# EAGLE design NQSMHS-V2.5b (EAGLE 5.11)

## Sheet 1 of 4
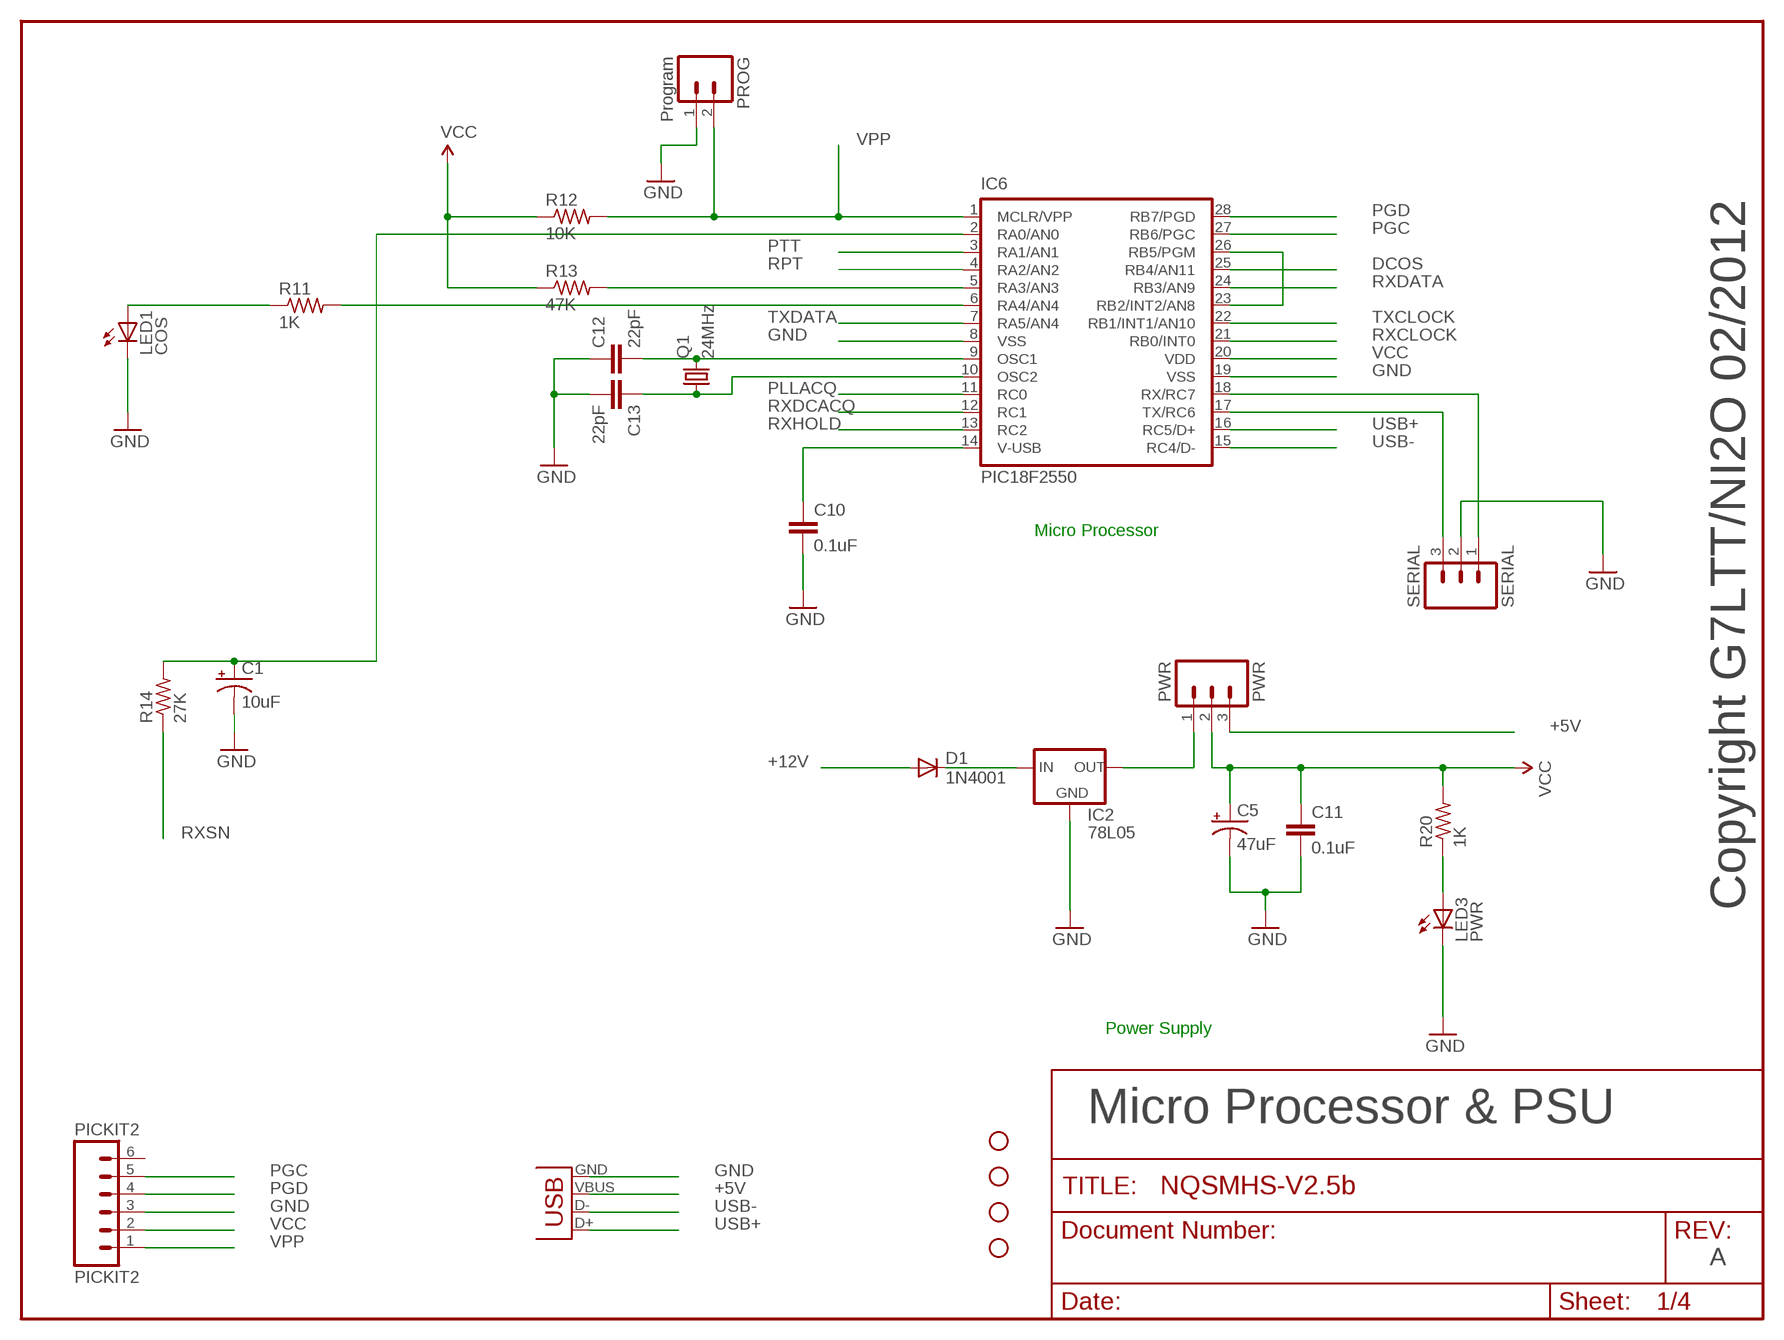
[diagram p0: schematic, sheet 1]

### Parts
C1  10uF  CAP_POLPTH2  [CPOL-RADIAL-10UF-25V]
C5  47uF  CAP_POLPTH2  [CPOL-RADIAL-10UF-25V]
C10  0.1uF  C2.5/2  [C2.5-2]
C11  0.1uF  C2.5/2  [C2.5-2]
C12  22pF  C2.5/2  [C2.5-2]
C13  22pF  C2.5/2  [C2.5-2]
D1  1N4001  DIODEPTH  [DIODE-1N4001]
IC2  78L05  78LXX  [78LXX]
IC6  PIC18F2550  [DIL28-3]
J1  USBPTH  [USB-B-PTH]
JP7  STAND-OFF  [STAND-OFF]
JP8  STAND-OFF  [STAND-OFF]
JP9  STAND-OFF  [STAND-OFF]
JP10  STAND-OFF  [STAND-OFF]
LED1  COS  LED3MM  [LED3MM]
LED3  PWR  LED3MM  [LED3MM]
PICKIT2  PICKIT2  M06SIP  [1X06]
PROG  Program  M02PTH  [1X02]
PWR  PWR  M03PTH  [1X03]
Q1  24MHz  CRYSTALHC49US  [HC49US]
R11  1K  R-US_0207/2V  [0207/2V]
R12  10K  R-US_0207/2V  [0207/2V]
R13  47K  R-US_0207/2V  [0207/2V]
R14  27K  R-US_0207/2V  [0207/2V]
R20  1K  R-US_0207/2V  [0207/2V]
SERIAL  SERIAL  M03PTH  [1X03]

### Nets
+5V: J1.VBUS PWR.3
+12V: D1.A ; also sheet 2
DCOS: IC6.25(RB4/AN11) ; also sheet 3
GND: C1.2(-) C5.2(-) C10.2 C11.2 C12.1 C13.2 IC2.GND IC6.8(VSS) IC6.19(VSS) J1.GND LED1.K(C) LED3.K(C) PICKIT2.3 PROG.1 SERIAL.2 ; also sheet 2,3,4
N$2: D1.C IC2.IN
N$3: IC6.23(RB2/INT2/AN8) IC6.26(RB5/PGM)
N$4: IC6.5(RA3/AN3) R13.2
N$5: IC6.6(RA4/AN4) R11.2
N$6: LED1.A R11.1
N$9: C12.2 IC6.9(OSC1) Q1.2
N$10: C13.1 IC6.10(OSC2) Q1.1
N$11: C10.1 IC6.14(V-USB)
N$12: IC2.OUT PWR.1
N$13: LED3.A R20.1
PGC: IC6.27(RB6/PGC) PICKIT2.5
PGD: IC6.28(RB7/PGD) PICKIT2.4
PLLACQ: IC6.11(RC0) ; also sheet 4
PTT: IC6.3(RA1/AN1) ; also sheet 2
RPT: IC6.4(RA2/AN2)
RX-232: IC6.18(RX/RC7) SERIAL.1
RXCLOCK: IC6.21(RB0/INT0) ; also sheet 4
RXDATA: IC6.24(RB3/AN9) ; also sheet 4
RXDCACQ: IC6.12(RC1) ; also sheet 4
RXHOLD: IC6.13(RC2) ; also sheet 4
RXSN: R14.1 ; also sheet 3,4
TX-232: IC6.17(TX/RC6) SERIAL.3
TX/SN: C1.1(+) IC6.2(RA0/AN0) R14.2
TXCLOCK: IC6.22(RB1/INT1/AN10) ; also sheet 4
TXDATA: IC6.7(RA5/AN4) ; also sheet 4
USB+: IC6.16(RC5/D+) J1.D+
USB-: IC6.15(RC4/D-) J1.D-
VCC: C5.1(+) C11.1 IC6.20(VDD) PICKIT2.2 PWR.2 R12.1 R13.1 R20.2 ; also sheet 2,3,4
VPP: IC6.1(MCLR/VPP) PICKIT2.1 PROG.2 R12.2
Unconnected: PICKIT2.6

### Notes on the sheet
- Micro Processor
- Copyright G7LTT/NI2O 02/2012
- Power Supply
- Micro Processor & PSU
- A

## Sheet 2 of 4
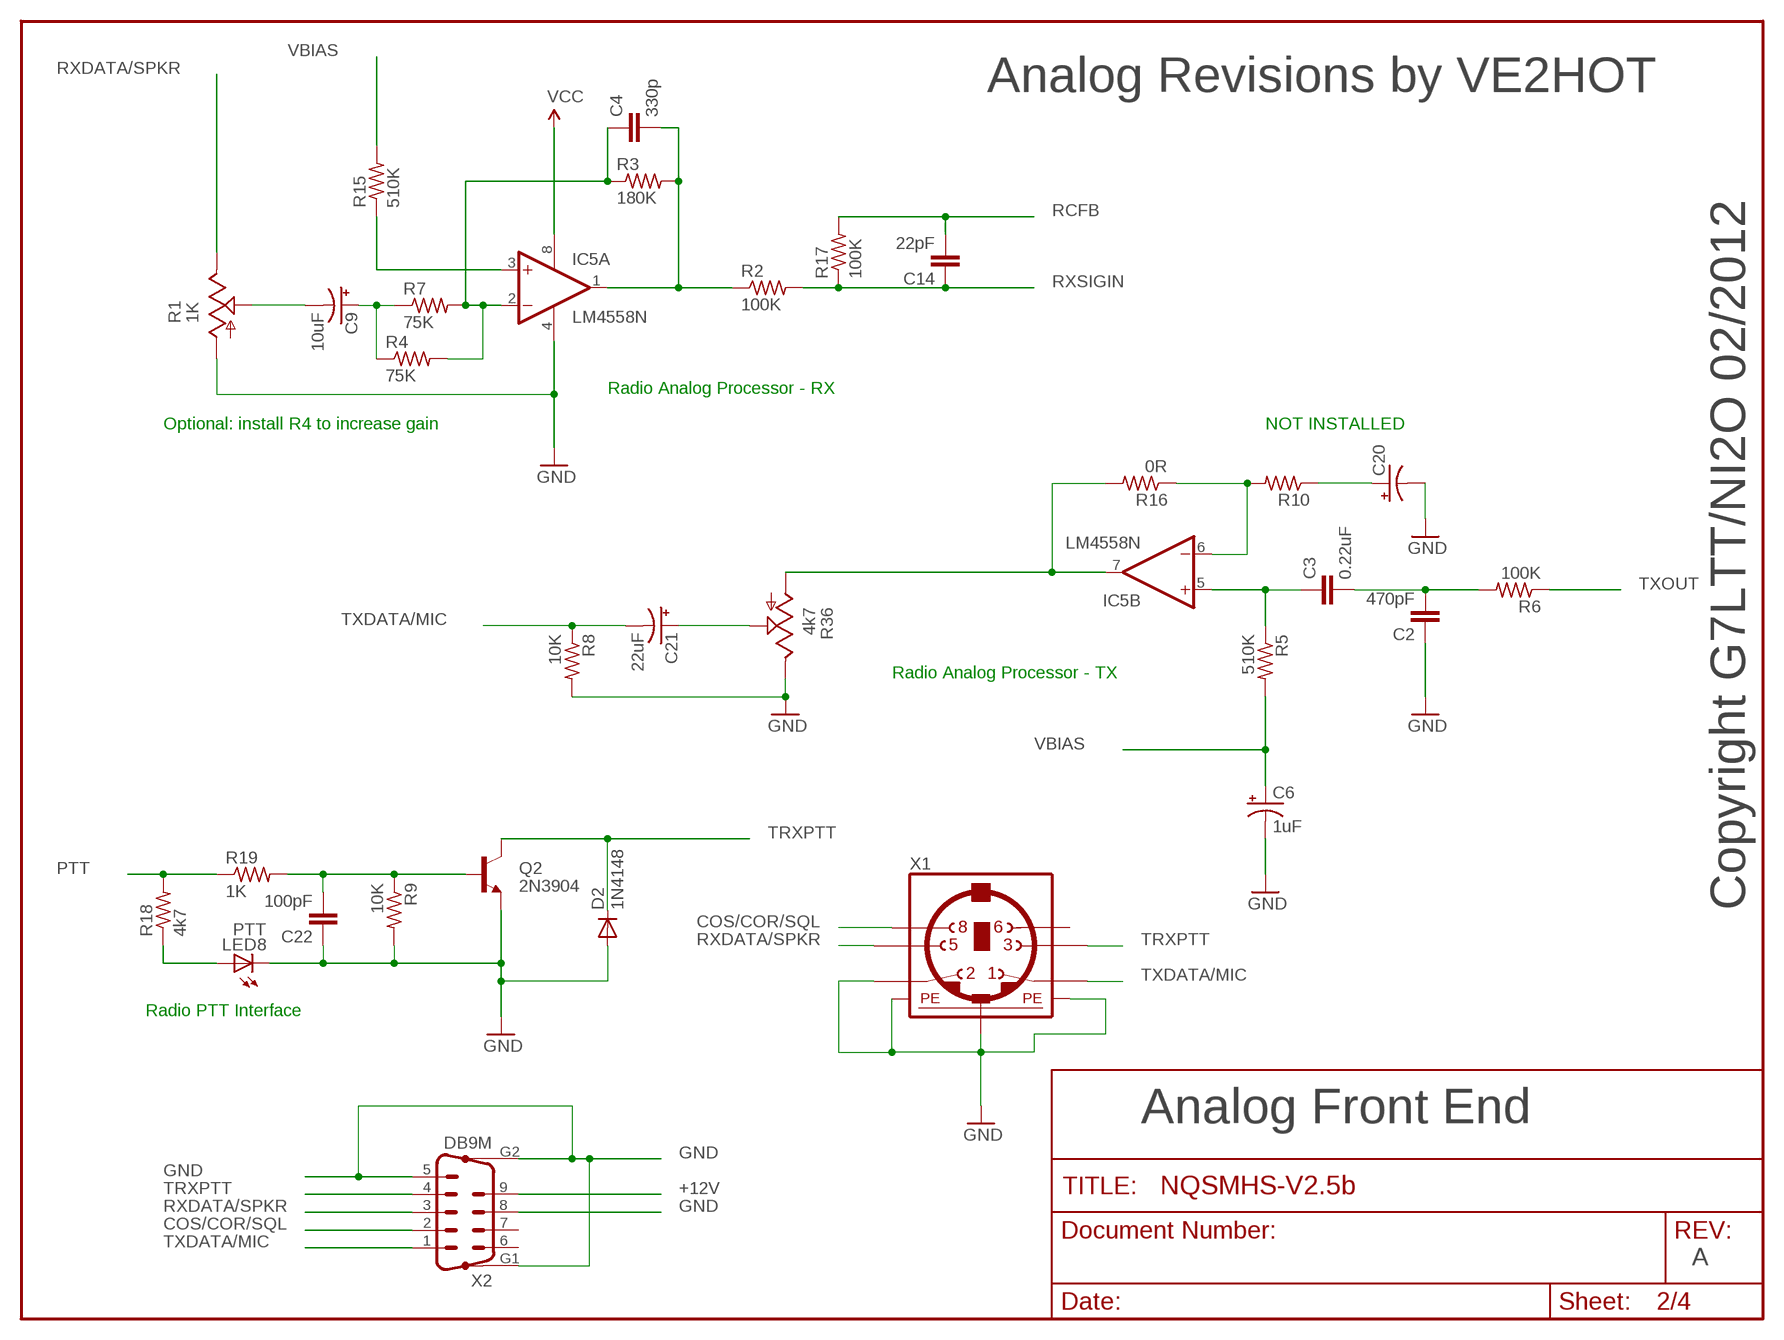
[diagram p1: schematic, sheet 2]

### Parts
C2  470pF  C2.5/2  [C2.5-2]
C3  0.22uF  C2.5/2  [C2.5-2]
C4  330p  C2.5/2  [C2.5-2]
C6  1uF  CAP_POLPTH2  [CPOL-RADIAL-10UF-25V]
C9  10uF  CAP_POLPTH2  [CPOL-RADIAL-10UF-25V]
C14  22pF  C2.5/2  [C2.5-2]
C20  CAP_POLPTH2  [CPOL-RADIAL-10UF-25V]
C21  22uF  CAP_POLPTH2  [CPOL-RADIAL-10UF-25V]
C22  100pF  C2.5/2  [C2.5-2]
D2  1N4148  [DO35-10]
IC5  LM4558N  [DIL08]
LED8  PTT  LED3MM  [LED3MM]
Q2  2N3904  TRANSISTOR_NPNTO92  [TO-92]
R1  1K  TRIM_US-CA6V  [CA6V]
R2  100K  R-US_0207/2V  [0207/2V]
R3  180K  R-US_0207/2V  [0207/2V]
R4  75K  R-US_0207/2V  [0207/2V]
R5  510K  R-US_0207/2V  [0207/2V]
R6  100K  R-US_0207/2V  [0207/2V]
R7  75K  R-US_0207/2V  [0207/2V]
R8  10K  R-US_0207/2V  [0207/2V]
R9  10K  R-US_0207/2V  [0207/2V]
R10  R-US_0207/2V  [0207/2V]
R15  510K  R-US_0207/2V  [0207/2V]
R16  0R  R-US_0207/2V  [0207/2V]
R17  100K  R-US_0207/2V  [0207/2V]
R18  4k7  R-US_0207/2V  [0207/2V]
R19  1K  R-US_0207/2V  [0207/2V]
R36  4k7  TRIM_US-CA6V  [CA6V]
X1  MINI_DIN_6  [M_DIN6]
X2  DB9M  M09HP  [M09HP]

### Nets
+12V: X2.9 ; also sheet 1
COS/COR/SQL: X1.8 X2.2
GND: C2.1 C6.2(-) C20.2(-) C22.1 D2.A IC5.4(P:V-) LED8.K(C) Q2.1(E) R1.A R8.2 R9.2 R36.E X1.2 X1.SH1(PE1) X1.SH2(PE2) X1.SH3(PE3) X2.5 X2.8 X2.G1 X2.G2 ; also sheet 1,3,4
N$8: C2.2 C3.2 R6.2
N$15: C22.2 Q2.2(B) R9.1 R19.2
N$17: LED8.A R18.1
N$18: C9.2(-) R1.S
N$19: IC5.7(B:OUT) R16.2 R36.A
N$20: C9.1(+) R4.1 R7.1
N$23: C4.2 IC5.1(A:OUT) R2.1 R3.2
N$25: C3.1 IC5.5(B:+IN) R5.1
N$26: C4.1 IC5.2(A:-IN) R3.1 R4.2 R7.2
N$27: IC5.6(B:-IN) R10.2 R16.1
N$28: C20.1(+) R10.1
N$29: C21.1(+) R36.S
N$40: IC5.3(A:+IN) R15.1
PTT: R18.2 R19.1 ; also sheet 1
RCFB: C14.2 R17.2 ; also sheet 4
RXDATA/SPKR: R1.E X1.5 X2.3
RXSIGIN: C14.1 R2.2 R17.1 ; also sheet 4
TRXPTT: D2.C Q2.3(C) X1.3 X2.4
TXDATA/MIC: C21.2(-) R8.1 X1.1 X2.1
TXOUT: R6.1 ; also sheet 4
VBIAS: C6.1(+) R5.2 R15.2 ; also sheet 4
VCC: IC5.8(P:V+) ; also sheet 1,3,4
Unconnected: X1.6 X2.6 X2.7

### Notes on the sheet
- Analog Revisions by VE2HOT
- Radio Analog Processor - RX
- Optional: install R4 to increase gain | NOT INSTALLED
- Radio Analog Processor - TX
- Copyright G7LTT/NI2O 02/2012
- Radio PTT Interface
- Analog Front End
- A

## Sheet 3 of 4
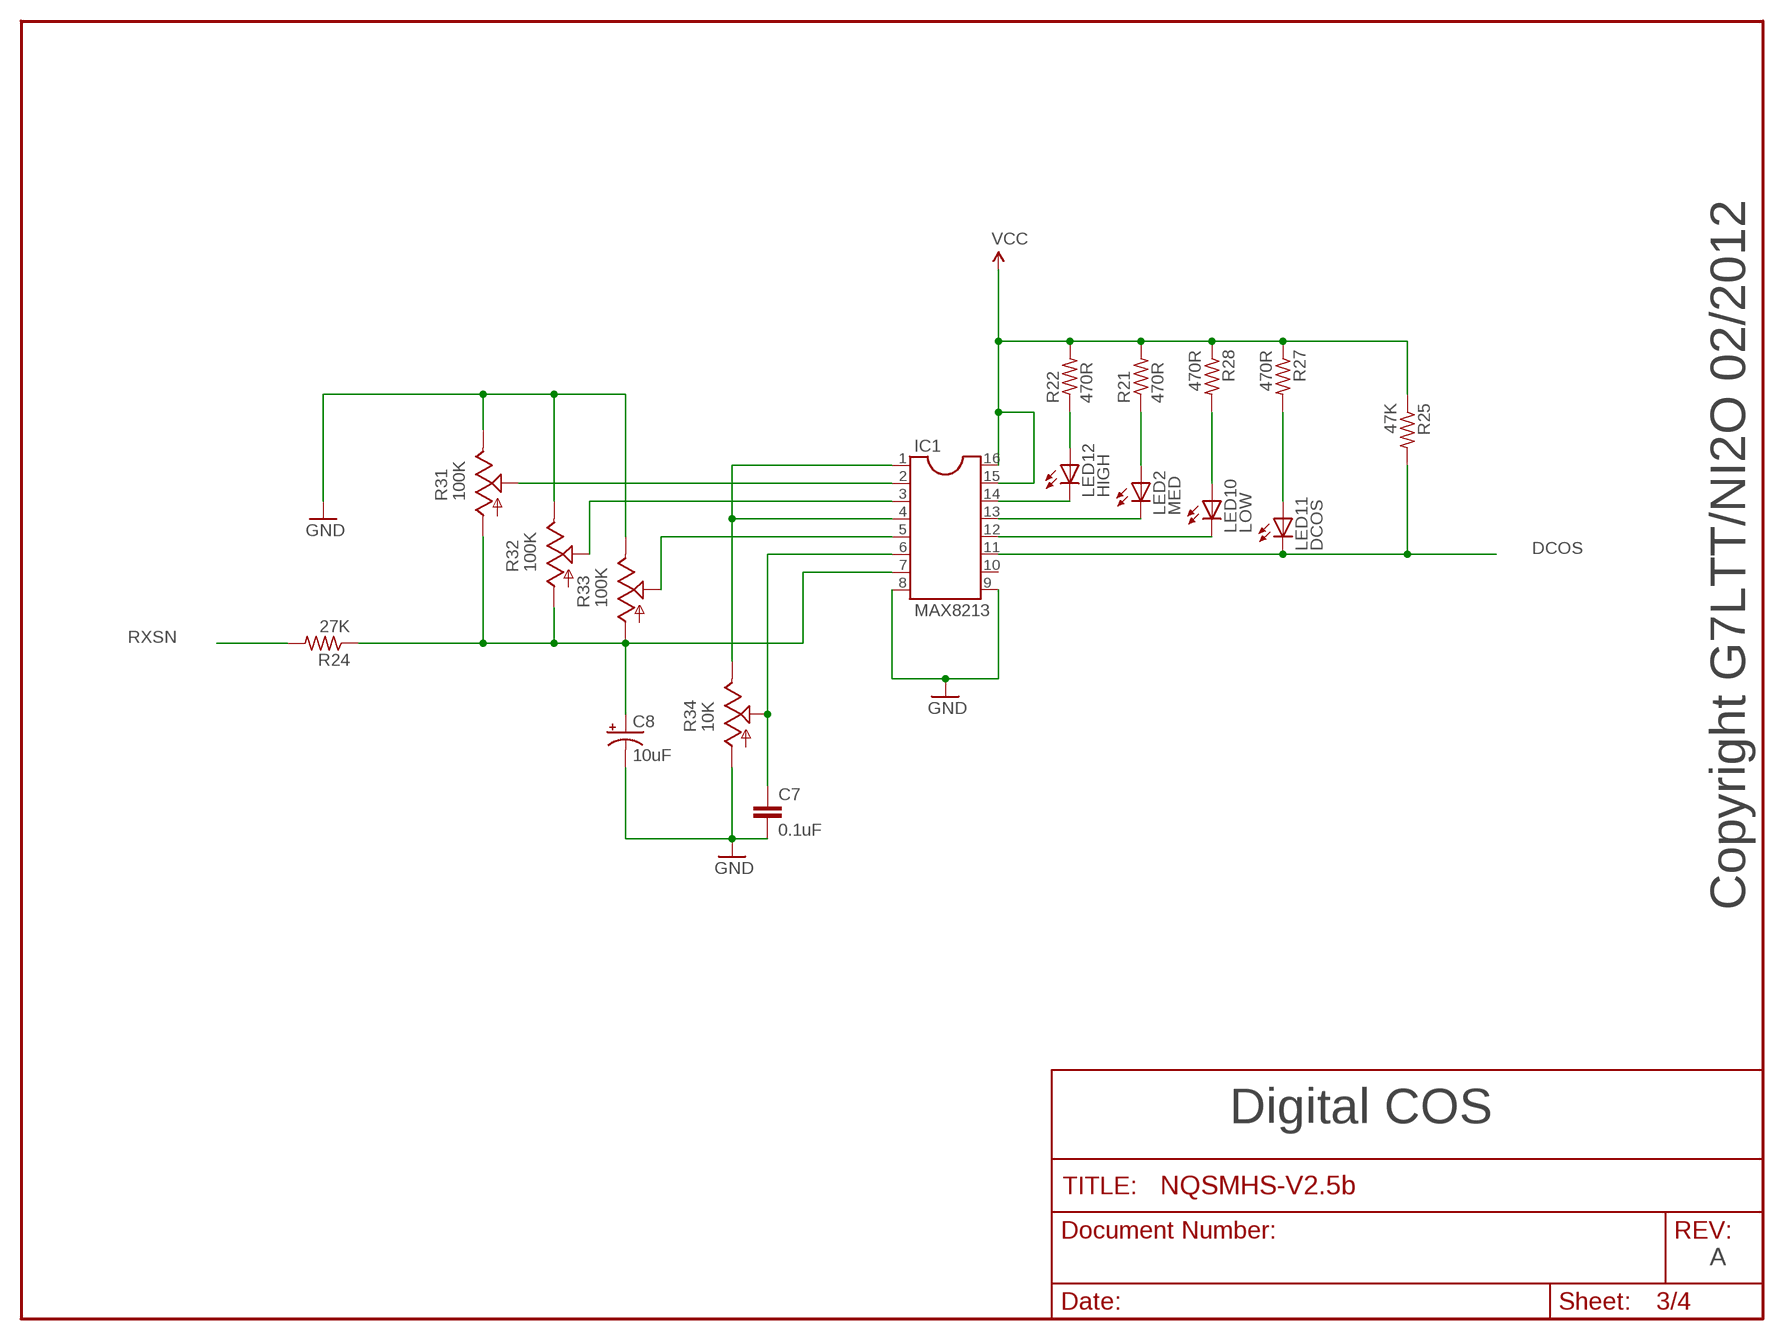
[diagram p2: schematic, sheet 3]

### Parts
C7  0.1uF  C2.5/2  [C2.5-2]
C8  10uF  CAP_POLPTH2  [CPOL-RADIAL-10UF-25V]
IC1  MAX8213  DIL16  [DIL16]
LED2  MED  LED3MM  [LED3MM]
LED10  LOW  LED3MM  [LED3MM]
LED11  DCOS  LED3MM  [LED3MM]
LED12  HIGH  LED3MM  [LED3MM]
R21  470R  R-US_0207/2V  [0207/2V]
R22  470R  R-US_0207/2V  [0207/2V]
R24  27K  R-US_0207/2V  [0207/2V]
R25  47K  R-US_0207/2V  [0207/2V]
R27  470R  R-US_0207/2V  [0207/2V]
R28  470R  R-US_0207/2V  [0207/2V]
R31  100K  TRIM_US-CA6V  [CA6V]
R32  100K  TRIM_US-CA6V  [CA6V]
R33  100K  TRIM_US-CA6V  [CA6V]
R34  10K  TRIM_US-CA6V  [CA6V]

### Nets
DCOS: IC1.11 LED11.K(C) R25.2 ; also sheet 1
GND: C7.2 C8.2(-) IC1.8 IC1.9 R31.E R32.E R33.E R34.A ; also sheet 1,2,4
N$14: C7.1 IC1.6 R34.S
N$16: IC1.14 LED12.K(C)
N$41: LED12.A R22.1
N$44: IC1.13 LED2.K(C)
N$45: LED2.A R21.1
N$46: IC1.12 LED10.K(C)
N$47: LED11.A R27.2
N$48: LED10.A R28.2
N$49: IC1.2 R31.S
N$50: IC1.3 R32.S
N$51: IC1.5 R33.S
N$52: IC1.1 IC1.4 R34.E
N$53: C8.1(+) IC1.7 R24.1 R31.A R32.A R33.A
RXSN: R24.2 ; also sheet 1,4
VCC: IC1.15 IC1.16 R21.2 R22.2 R25.1 R27.1 R28.1 ; also sheet 1,2,4
Unconnected: IC1.10

### Notes on the sheet
- Copyright G7LTT/NI2O 02/2012
- Digital COS
- A

## Sheet 4 of 4
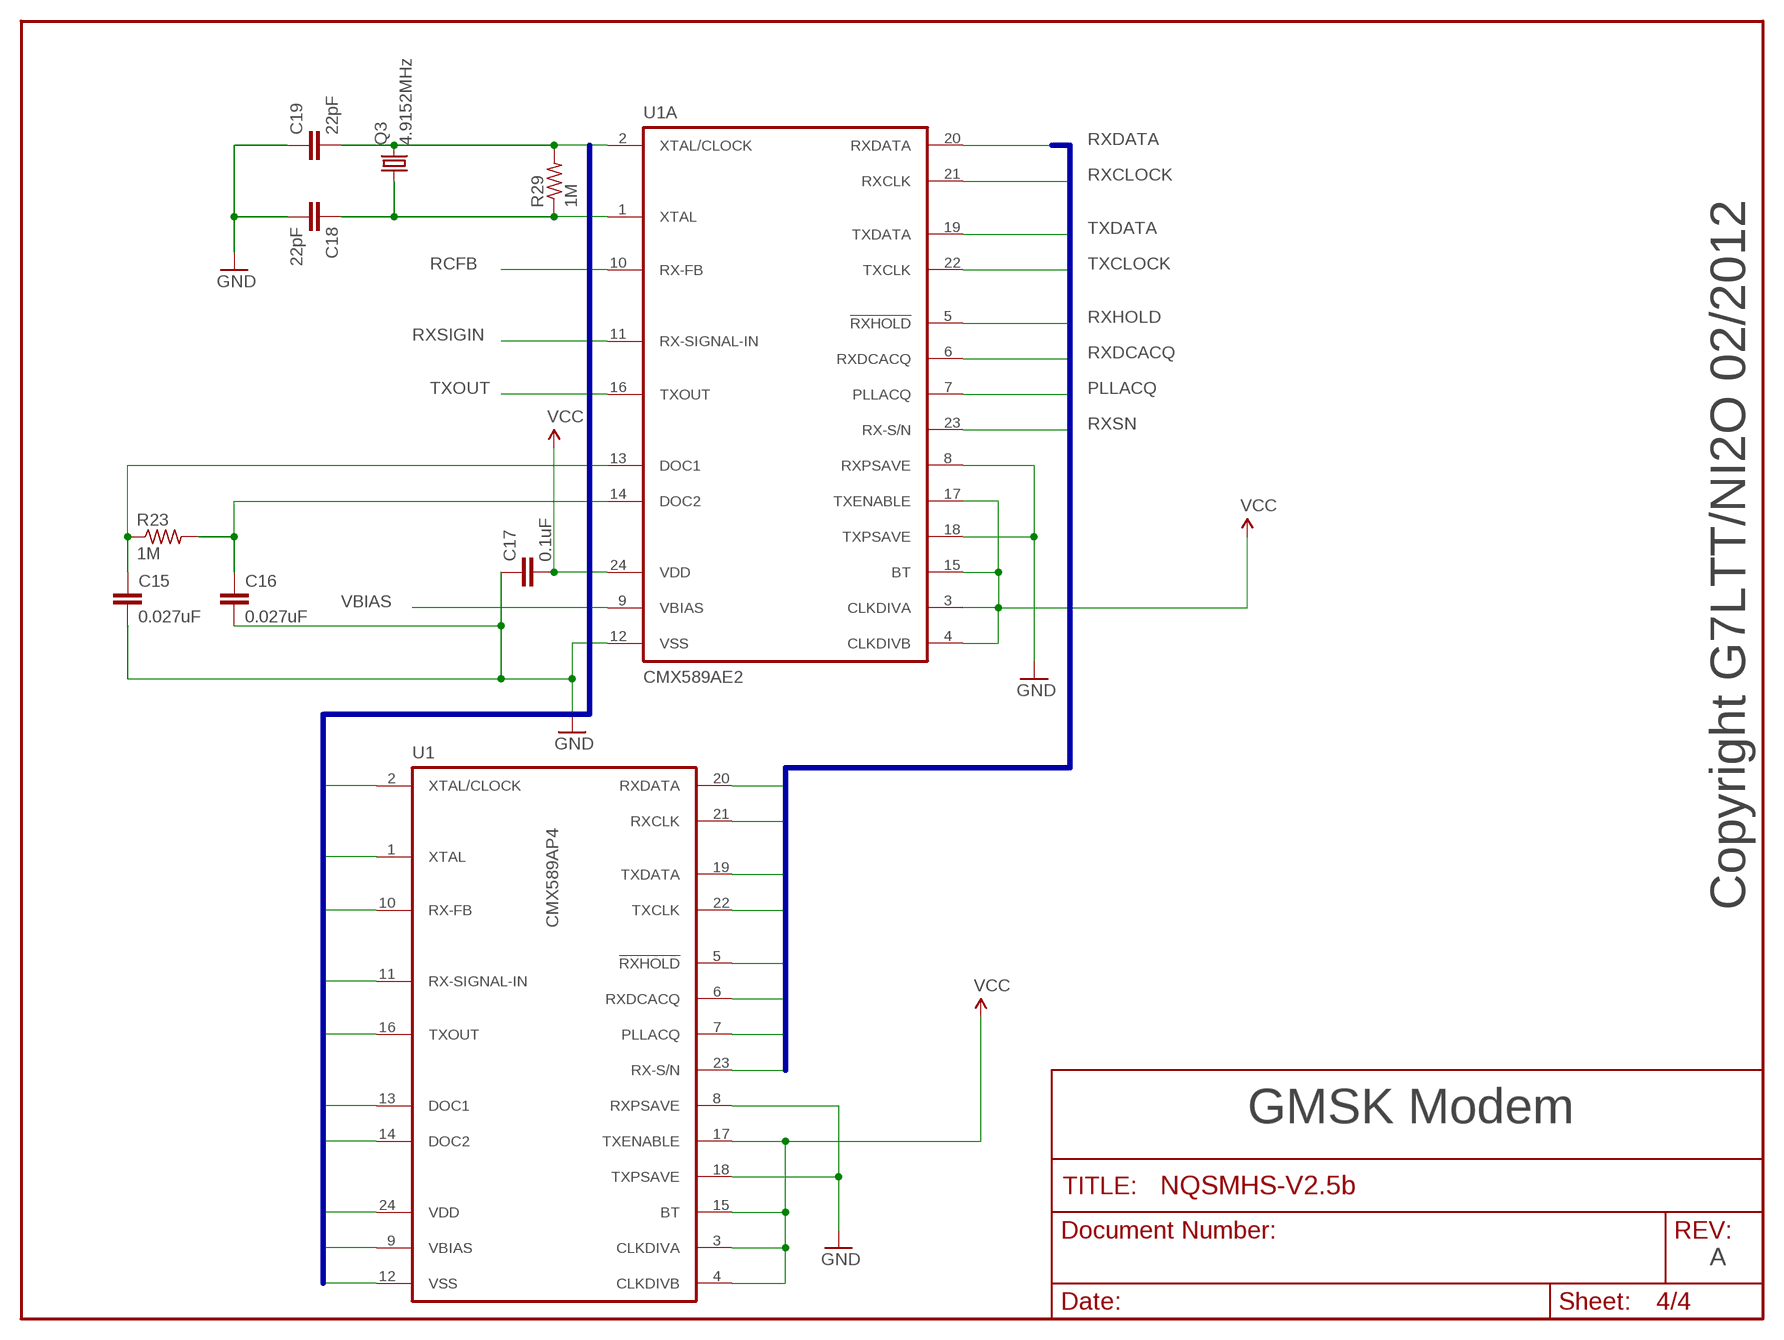
[diagram p3: schematic, sheet 4]

### Parts
C15  0.027uF  C2.5/2  [C2.5-2]
C16  0.027uF  C2.5/2  [C2.5-2]
C17  0.1uF  C2.5/2  [C2.5-2]
C18  22pF  C2.5/2  [C2.5-2]
C19  22pF  C2.5/2  [C2.5-2]
Q3  4.9152MHz  CRYSTALHC49US  [HC49US]
R23  1M  R-US_0207/2V  [0207/2V]
R29  1M  R-US_0207/2V  [0207/2V]
U1  CMX589AP4  [DIL24-6]
U1A  CMX589AE2  [TSSOP24]

### Nets
GND: C15.2 C16.2 C17.1 C18.2 C19.1 U1.8(RXPSAVE) U1.12(VSS) U1.18(TXPSAVE) U1A.8(RXPSAVE) U1A.12(VSS) U1A.18(TXPSAVE) ; also sheet 1,2,3
N$1: C15.1 R23.1 U1.13(DOC1) U1A.13(DOC1)
N$21: C16.1 R23.2 U1.14(DOC2) U1A.14(DOC2)
N$22: C18.1 Q3.1 R29.1 U1.1(XTAL) U1A.1(XTAL)
N$24: C19.2 Q3.2 R29.2 U1.2(XTAL/CLOCK) U1A.2(XTAL/CLOCK)
N$32: U1.22(TXCLK)
PLLACQ: U1.7(PLLACQ) U1A.7(PLLACQ) ; also sheet 1
RCFB: U1.10(RX-FB) U1A.10(RX-FB) ; also sheet 2
RXCLOCK: U1.21(RXCLK) U1A.21(RXCLK) ; also sheet 1
RXDATA: U1.20(RXDATA) U1A.20(RXDATA) ; also sheet 1
RXDCACQ: U1.6(RXDCACQ) U1A.6(RXDCACQ) ; also sheet 1
RXHOLD: U1.5(!RXHOLD!) U1A.5(!RXHOLD!) ; also sheet 1
RXSIGIN: U1.11(RX-SIGNAL-IN) U1A.11(RX-SIGNAL-IN) ; also sheet 2
RXSN: U1.23(RX-S/N) U1A.23(RX-S/N) ; also sheet 1,3
TXCLOCK: U1.19(TXDATA) U1A.22(TXCLK) ; also sheet 1
TXDATA: U1A.19(TXDATA) ; also sheet 1
TXOUT: U1.16(TXOUT) U1A.16(TXOUT) ; also sheet 2
VBIAS: U1.9(VBIAS) U1A.9(VBIAS) ; also sheet 2
VCC: C17.2 U1.3(CLKDIVA) U1.4(CLKDIVB) U1.15(BT) U1.17(TXENABLE) U1.24(VDD) U1A.3(CLKDIVA) U1A.4(CLKDIVB) U1A.15(BT) U1A.17(TXENABLE) U1A.24(VDD) ; also sheet 1,2,3

### Buses
B$1
B$2

### Notes on the sheet
- Copyright G7LTT/NI2O 02/2012
- GMSK Modem
- A

## Library data of the parts
C1 C5 C6 C8 C9 C20 C21 = SparkFun:CAP_POL: Capacitor Polarized These are standard SMD and PTH capacitors. Normally 10uF, 47uF, and 100uF in electrolytic and tantalum varieties. Always verify the external diameter of the through hole cap, it varies with capacity, voltage, and manufacturer. The EIA devices should be standard.
C2-C4 C7 C10-C19 C22 = capacitor-wima:C: CAPACITOR naming: grid - package width
D1 = SparkFun:DIODE: Diode These are standard reverse protection diodes and small signal diodes. SMA package can handle up to about 1A. SOD-323 can handle about 200mA. What the SOD-323 package when ordering, there are some mfgs out there that are 5-pin packages.
D2 = diode-1:1N4148: DIODE high speed (Philips)
IC1 = ic-package:DIL16: Dual In Line / Socket
IC2 = v-reg:78LXX: VOLTAGE REGULATOR
IC5 = linear:*4558: OP AMP
IC6 = SparkFun:PIC18F2550
J1 = SparkFun:USB: USB Connectors USB-B-PTH is fully proven SKU : PRT-00139 USB-miniB is fully proven SKU : PRT-00587 USB-A-PCB is untested. USB-A-H is throughly reviewed, but untested. Spark Fun Electronics SKU : PRT-00437 USB-B-SMT is throughly reviewed, but untested. Needs silkscreen touching up. USB-A-S has not been used/tested USB-MB-H has not been used/tested
JP7-JP10 = SparkFun:STAND-OFF: Stand Off This is the mechanical footprint for a #4 phillips button head screw. Use the keepout ring to avoid running the screw head into surrounding components. SKU : PRT-00447
LED1-LED3 LED8 LED10-LED12 = SparkFun:LED: LEDs Standard schematic elements and footprints for 5mm, 3mm, 1206, and 0603 sized LEDs. 5mm - Spark Fun Electronics SKU : COM-00529 (and others)
PICKIT2 = SparkFun:M06: Header 6 Standard 6-pin 0.1" header. Use with straight break away headers (SKU : PRT-00116), right angle break away headers (PRT-00553), swiss pins (PRT-00743), machine pins (PRT-00117), and female headers (PRT-00115). Molex polarized connector foot print use with SKU : PRT-08094 with associated crimp pins and housings. NOTES ON THE VARIANTS LOCK and LOCK_LONGPADS... This footprint was designed to help hold the alignment of a through-hole component (i.e. 6-pin header) while soldering it into place. You may notice that each hole has been shifted either up or down by 0.005 of an inch from it's more standard position (which is a perfectly straight line). This slight alteration caused the pins (the squares in the middle) to touch the edges of the holes. Because they are alternating, it causes a "brace" to hold the component in place. 0.005 has proven to be the perfect amount of "off-center" position when using our standard breakaway headers. Although looks a little odd when you look at the bare footprint, once you have a header in there, the alteration is very hard to notice. Also, if you push a header all the way into place, it is covered up entirely on the bottom side. This idea of altering the position of holes to aid alignment will be further integrated into the Sparkfun Library for other footprints. It can help hold any component with 3 or more connection pins.
PROG = SparkFun:M02: Header 2 Standard 2-pin 0.1" header. Use with straight break away headers (SKU : PRT-00116), right angle break away headers (PRT-00553), swiss pins (PRT-00743), machine pins (PRT-00117), and female headers (PRT-00115). Molex polarized connector foot print use with SKU : PRT-08233 with associated crimp pins and housings.
PWR SERIAL = SparkFun:M03: Header 3 Standard 3-pin 0.1" header. Use with straight break away headers (SKU : PRT-00116), right angle break away headers (PRT-00553), swiss pins (PRT-00743), machine pins (PRT-00117), and female headers (PRT-00115). Molex polarized connector foot print use with SKU : PRT-08232 with associated crimp pins and housings.
Q1 Q3 = SparkFun:CRYSTAL: Crystals Various standard crystals. Proven footprints. Spark Fun Electronics SKU : COM-00534
Q2 = SparkFun:TRANSISTOR_NPN: Transistor NPN BJT configuration in SOT23 package. MMBT2222 is the common NPN we use. Double check BCE configuration again layout.
R1 R31-R34 R36 = pot:TRIM_US-: POTENTIOMETER
R2-R25 R27-R29 = resistor:R-US_: RESISTOR, American symbol
U1 U1A = cml-micro:CMX589A: HIGH-SPEED GMSK MODEM
X1 = mini_din:MINI_DIN_6
X2 = con-subd:M09HP: SUB-D

## Board
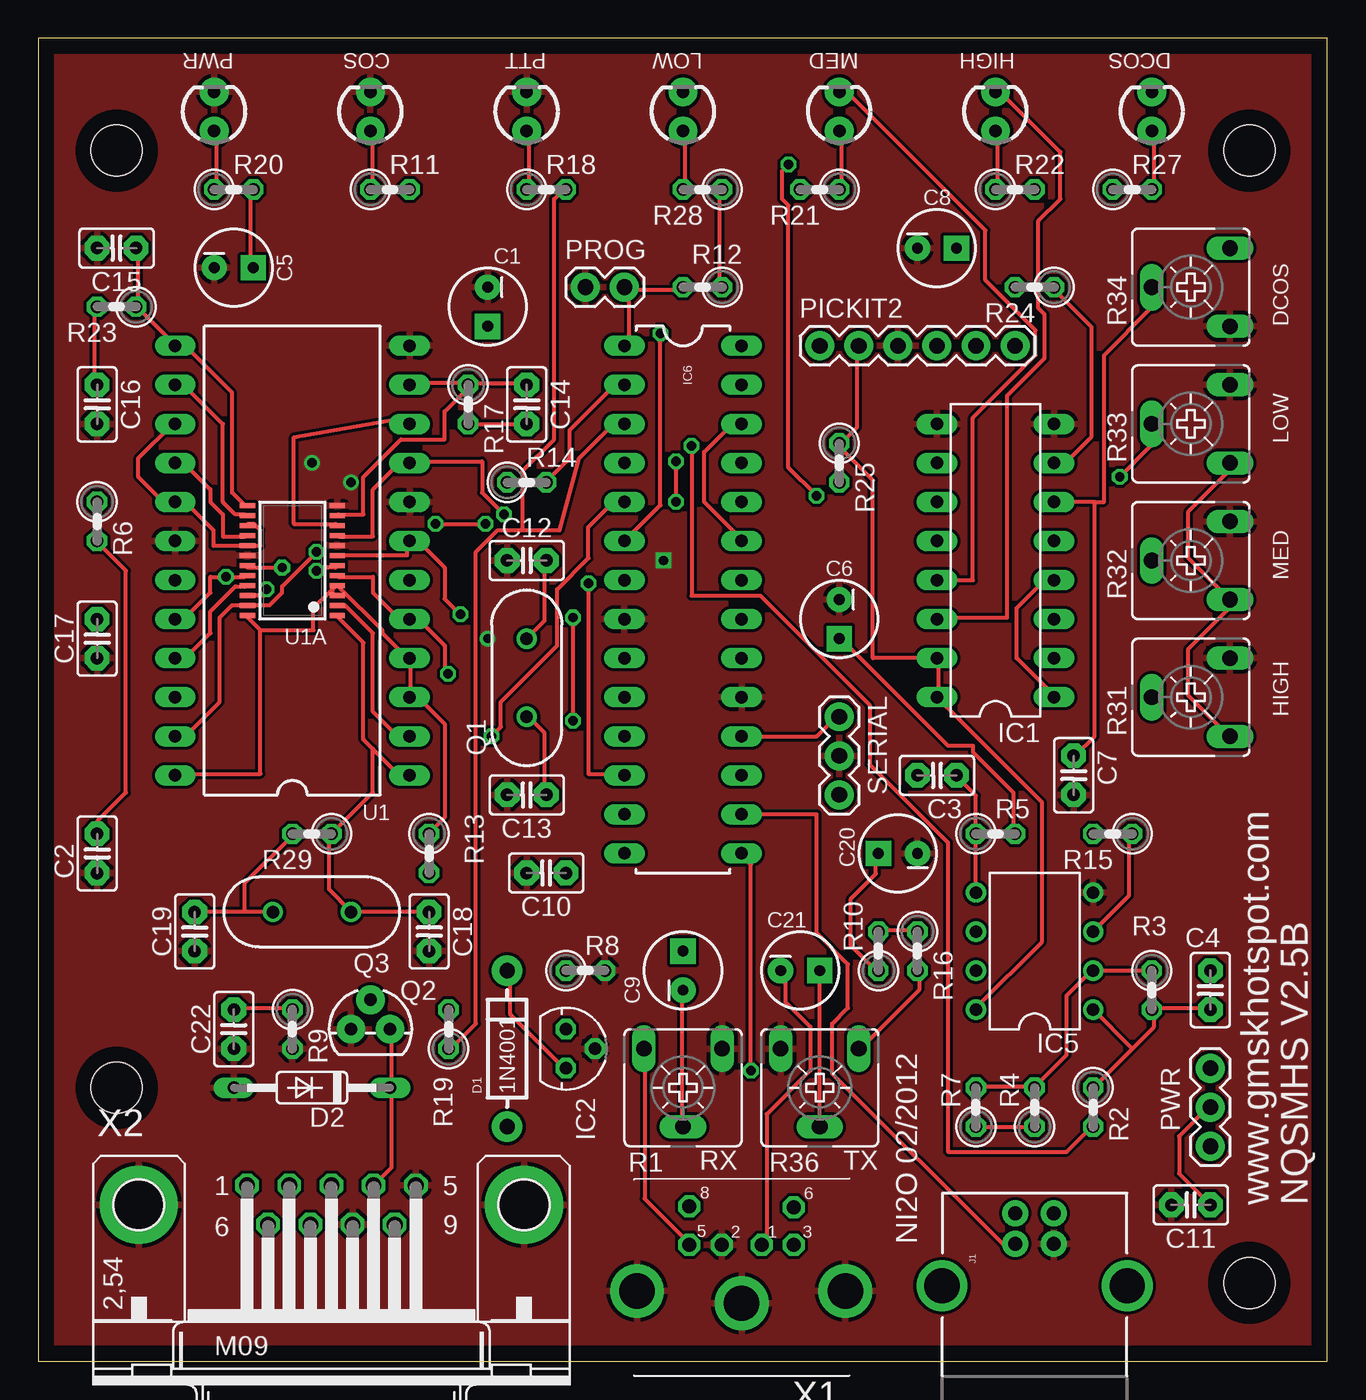
[diagram p4: board, top side]
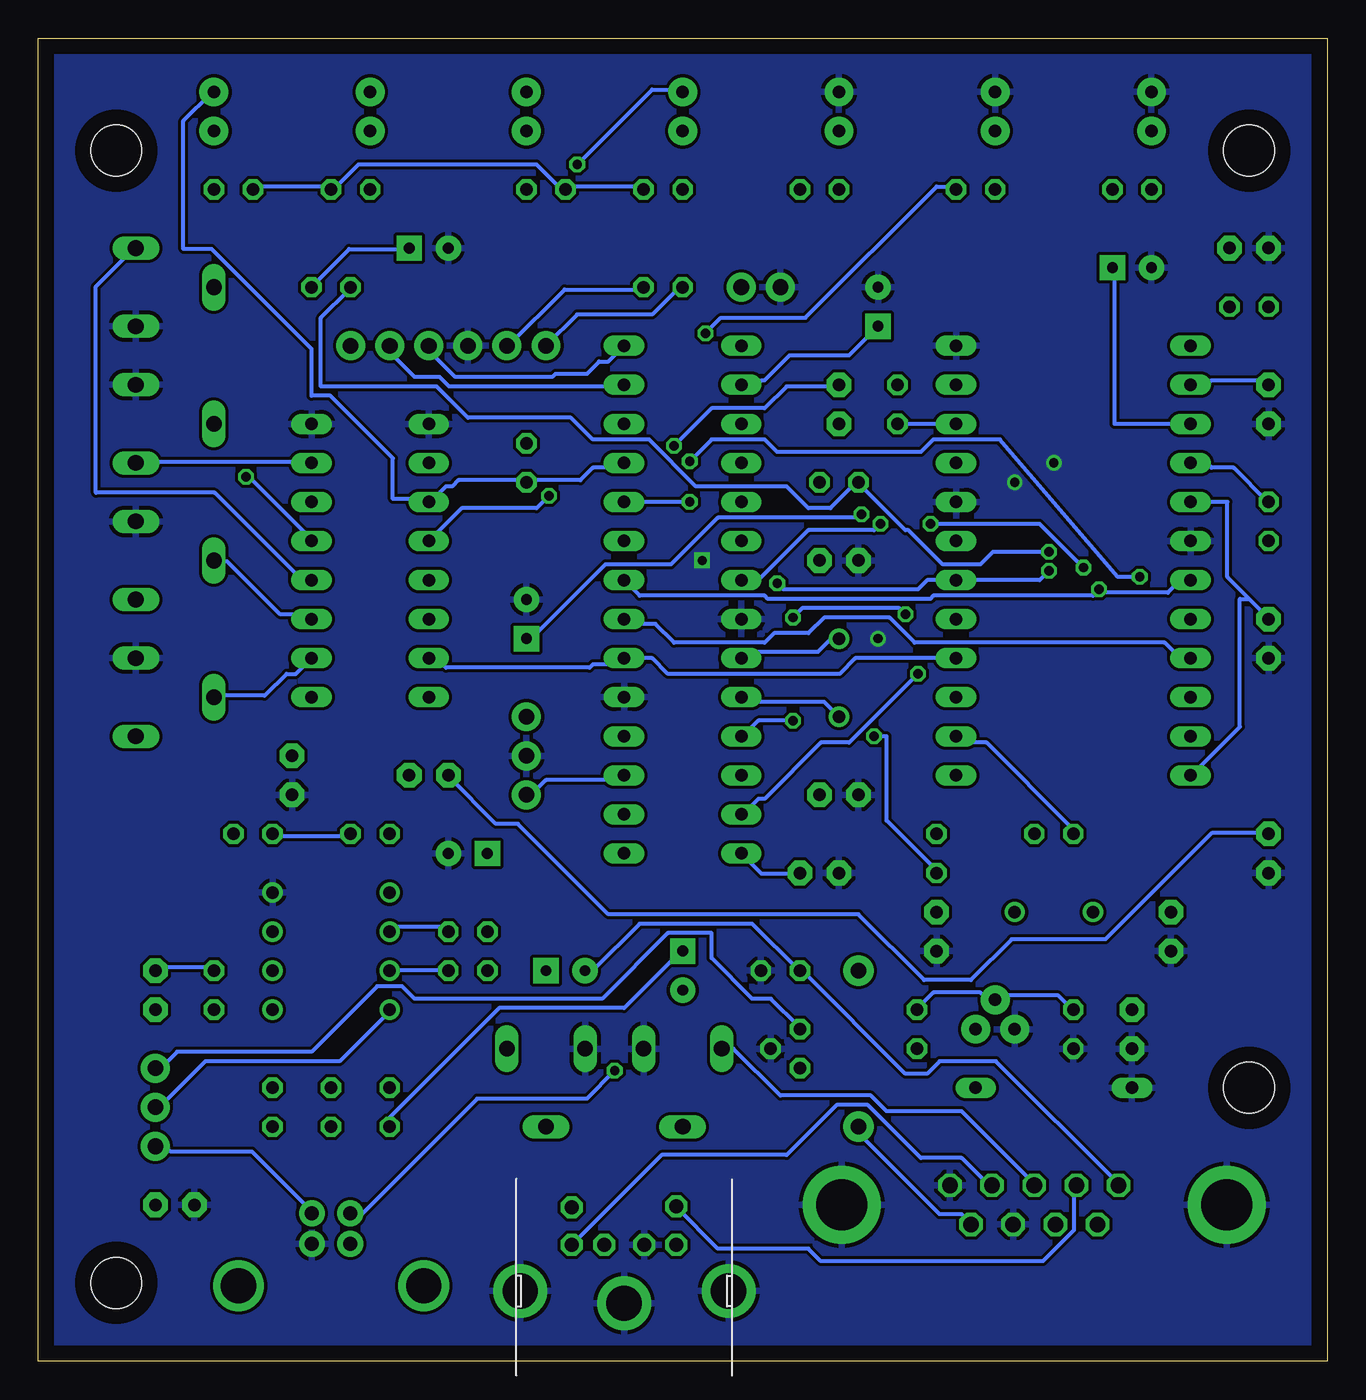
[diagram p5: board, bottom side, seen from below]

Size 83.8 x 86.03 mm. Coordinates in mm from the lower left corner, seen from the top.
Outline: 0,0 83.8,0 83.8,86.03 0,86.03 0,0
Copper layers (1*16): Top 0.035mm / dielectric 1.5mm / Bottom 0.035mm
Design rules "default": minimum track width 10mil, minimum drill 24mil, track to track 8mil, track to pad 8mil, pad to pad 8mil, via to via 8mil, smd to smd 8mil, copper to edge 40mil, drill to drill 8mil, minimum pad ring 10mil, minimum via ring 8mil, stop-mask expansion 4mil, vias tented up to drill 0mil, thermal gap 10mil

### Footprints (pad centres in the part's own frame; a part is rotated, then mirrored left to right if it is on the bottom)
CPOL-RADIAL-10UF-25V = drill 0.7 pad 1.651 square: 1 1.27,0 | drill 0.7 pad 1.651 round: 2 -1.27,0
C2.5-2 = drill 0.813 pad 1.6 octagon: 1 -1.27,0; 2 1.27,0
DIODE-1N4001 = drill 1 pad 1.981 round: A -5.08,0; C 5.08,0
DO35-10 = drill 0.813 long: A 5.08,0; C -5.08,0
DIL16 = drill 0.813 long: 1 -8.89,-3.81; 2 -6.35,-3.81; 3 -3.81,-3.81; 4 -1.27,-3.81; 5 1.27,-3.81; 6 3.81,-3.81; 7 6.35,-3.81; 8 8.89,-3.81; 9 8.89,3.81; 10 6.35,3.81; 11 3.81,3.81; 12 1.27,3.81; 13 -1.27,3.81; 14 -3.81,3.81; 15 -6.35,3.81; 16 -8.89,3.81
78LXX = drill 0.813 octagon: GND 0,1.905; IN 1.27,0; OUT -1.27,0
DIL08 = drill 0.813 pad 1.27 round: 1 -3.81,-3.81; 2 -1.27,-3.81; 3 1.27,-3.81; 4 3.81,-3.81; 5 3.81,3.81; 6 1.27,3.81; 7 -1.27,3.81; 8 -3.81,3.81
DIL28-3 = drill 0.813 long: 1 -16.51,-3.81; 2 -13.97,-3.81; 3 -11.43,-3.81; 4 -8.89,-3.81; 5 -6.35,-3.81; 6 -3.81,-3.81; 7 -1.27,-3.81; 8 1.27,-3.81; 9 3.81,-3.81; 10 6.35,-3.81; 11 8.89,-3.81; 12 11.43,-3.81; 13 13.97,-3.81; 14 16.51,-3.81; 15 16.51,3.81; 16 13.97,3.81; 17 11.43,3.81; 18 8.89,3.81; 19 6.35,3.81; 20 3.81,3.81; 21 1.27,3.81; 22 -1.27,3.81; 23 -3.81,3.81; 24 -6.35,3.81; 25 -8.89,3.81; 26 -11.43,3.81; 27 -13.97,3.81; 28 -16.51,3.81
USB-B-PTH = drill 0.914 pad 1.676 round: D+ 0,1.25; D- 1.981,1.25; GND 0,-1.25; VBUS 1.981,-1.25 | drill 2.286 round: P$1 -2.718,-6.02; P$2 -2.718,6.02
STAND-OFF = hole 3.302: 0,0
LED3MM = drill 0.813 pad 1.88 round: A -1.27,0; K 1.27,0
1X06 = drill 1.016 pad 1.88 round: 1 0,0; 2 2.54,0; 3 5.08,0; 4 7.62,0; 5 10.16,0; 6 12.7,0
1X02 = drill 1.016 pad 1.88 round: 1 0,0; 2 2.54,0
1X03 = drill 1.016 pad 1.88 round: 1 0,0; 2 2.54,0; 3 5.08,0
HC49US = drill 0.813 round: 1 -2.54,0; 2 2.54,0
TO-92 = drill 0.813 pad 1.88 round: 1 -1.27,0; 2 0,1.905; 3 1.27,0
CA6V = drill 1.016 long: A -2.54,-2.54; E 2.54,-2.54; S 0,2.54
0207/2V = drill 0.813 octagon: 1 -1.27,0; 2 1.27,0
DIL24-6 = drill 0.813 long: 1 -13.97,-7.62; 2 -11.43,-7.62; 3 -8.89,-7.62; 4 -6.35,-7.62; 5 -3.81,-7.62; 6 -1.27,-7.62; 7 1.27,-7.62; 8 3.81,-7.62; 9 6.35,-7.62; 10 8.89,-7.62; 11 11.43,-7.62; 12 13.97,-7.62; 13 13.97,7.62; 14 11.43,7.62; 15 8.89,7.62; 16 6.35,7.62; 17 3.81,7.62; 18 1.27,7.62; 19 -1.27,7.62; 20 -3.81,7.62; 21 -6.35,7.62; 22 -8.89,7.62; 23 -11.43,7.62; 24 -13.97,7.62
TSSOP24 = smd 0.305 x 0.991: 1 -3.575,-2.918; 2 -2.925,-2.918; 3 -2.275,-2.918; 4 -1.625,-2.918; 5 -0.975,-2.918; 6 -0.325,-2.918; 7 0.325,-2.918; 8 0.975,-2.918; 9 1.625,-2.918; 10 2.275,-2.918; 11 2.925,-2.918; 12 3.575,-2.918; 13 3.575,2.918; 14 2.925,2.918; 15 2.275,2.918; 16 1.625,2.918; 17 0.975,2.918; 18 0.325,2.918; 19 -0.325,2.918; 20 -0.975,2.918; 21 -1.625,2.918; 22 -2.275,2.918; 23 -2.925,2.918; 24 -3.575,2.918
M_DIN6 = drill 0.9 pad 1.422 octagon: 1 -1.3,-3.75; 2 1.3,-3.75; 3 -3.4,-3.75; 5 3.4,-3.75; 6 -3.4,-6.2; 8 3.4,-6.25 | drill 2.3 pad 3.5 round: SH1 6.8,-0.75; SH2 0,0.05; SH3 -6.75,-0.75
M09HP = drill 1.016 octagon: 1 -5.486,1.27; 2 -2.743,1.27; 3 0,1.27; 4 2.743,1.27; 5 5.486,1.27; 6 -4.115,-1.27; 7 -1.372,-1.27; 8 1.372,-1.27; 9 4.115,-1.27 | drill 3.302 pad 5.08 round: G1 -12.522,0; G2 12.522,0

### Placement (x,y rotation side)
C1  29.21,68.58 270 top
C2  3.81,33.02 90 top
C3  58.42,38.1 180 top
C4  76.2,24.13 270 top
C5  12.7,71.12 0 top
C6  52.07,48.26 270 top
C7  67.31,38.1 270 top
C8  58.42,72.39 0 top
C9  41.91,25.4 90 top
C10  33.02,31.75 180 top
C11  74.93,10.16 180 top
C12  31.75,52.07 0 top
C13  31.75,36.83 180 top
C14  31.75,62.23 270 top
C15  5.08,72.39 180 top
C16  3.81,62.23 270 top
C17  3.81,46.99 90 top
C18  25.4,27.94 270 top
C19  10.16,27.94 90 top
C20  55.88,33.02 180 top
C21  49.53,25.4 0 top
C22  12.7,21.59 90 top
D1  30.48,20.32 90 top
D2  17.78,17.78 180 top
IC1  62.23,52.07 90 top
IC2  34.29,20.32 270 top
IC5  64.77,26.67 90 top
IC6  41.91,49.53 270 top
J1  64.77,7.62 90 top
JP7  5.08,17.78 0 top
JP8  78.74,5.08 0 top
JP9  5.08,78.74 0 top
JP10  78.74,78.74 0 top
LED1  21.59,81.28 90 top
LED2  52.07,81.28 90 top
LED3  11.43,81.28 90 top
LED8  31.75,81.28 90 top
LED10  41.91,81.28 90 top
LED11  72.39,81.28 90 top
LED12  62.23,81.28 90 top
PICKIT2  50.8,66.04 0 top
PROG  35.56,69.85 0 top
PWR  76.2,19.05 270 top
Q1  31.75,44.45 90 top
Q2  21.59,21.59 0 top
Q3  17.78,29.21 180 top
R1  41.91,17.78 180 top
R2  68.58,16.51 270 top
R3  72.39,24.13 270 top
R4  64.77,16.51 90 top
R5  62.23,34.29 0 top
R6  3.81,54.61 270 top
R7  60.96,16.51 90 top
R8  35.56,25.4 0 top
R9  16.51,21.59 270 top
R10  54.61,26.67 90 top
R11  22.86,76.2 0 top
R12  43.18,69.85 180 top
R13  25.4,33.02 270 top
R14  31.75,57.15 0 top
R15  69.85,34.29 180 top
R16  57.15,26.67 270 top
R17  27.94,62.23 270 top
R18  33.02,76.2 0 top
R19  26.67,21.59 90 top
R20  12.7,76.2 0 top
R21  50.8,76.2 180 top
R22  63.5,76.2 0 top
R23  5.08,68.58 180 top
R24  64.77,69.85 180 top
R25  52.07,58.42 270 top
R27  71.12,76.2 0 top
R28  43.18,76.2 180 top
R29  17.78,34.29 180 top
R31  74.93,43.18 90 top
R32  74.93,52.07 90 top
R33  74.93,60.96 90 top
R34  74.93,69.85 90 top
R36  50.8,17.78 180 top
SERIAL  52.07,41.91 270 top
U1  16.51,52.07 90 top
U1A  16.51,52.07 90 top
X1  45.72,3.81 180 top
X2  19.05,10.16 0 top

### Tracks (layer width: path | path; a pad name or v marks a point on that pad's centre or on a via)
+5V
  Bottom 0.254: J1.VBUS 66.04,9.75 69.9,13.61 75.18,13.61 75.39,13.82 76.2,13.82 PWR.3
+12V
  Bottom 0.254: D1.A 30.48,14.83 25.2,9.55 23.77,9.55 23.16,8.94 X2.9
COS/COR/SQL
  Bottom 0.254: X1.8 42.27,9.96 39.62,7.32 33.73,7.32 32.92,6.5 18.49,6.5 16.46,8.53 16.46,11.38 X2.2
DCOS
  Bottom 0.254: IC6.25 45.72,58.32 45.92,58.12 47.75,58.12 48.56,57.3 52.02,57.3 R25.2 52.22,57.3 56.49,57.3 56.9,56.9 57.3,56.9 58.12,56.08 | 58.12,56.08 58.32,55.88 IC1.11 58.12,56.08 | 58.12,56.08 60.76,56.08 60.76,58.73 64.82,62.79 66.04,62.79 66.04,65.84 72.54,72.34 74.37,72.34 74.37,80.67 72.54,82.5 LED11.K
GND  (via drill 0.6)
  other vias: 40.64,52.07 17.78,58.42 20.32,57.15 29.21,46.99
  pour Bottom: 0,0 83.82,0 83.82,86.36 0,86.36
  pour Top: 0,0 83.82,0 83.82,86.36 0,86.36
N$1
  Top 0.254: U1A.13 13.41,55.68 12.6,56.49 12.6,62.99 9.55,66.04 U1.13 8.74,66.04 8.74,66.24 6.5,68.48 R23.1 6.5,68.68 6.5,72.34 C15.1
N$2
  Top 0.254: D1.C 30.68,25.2 30.68,22.55 34.14,19.1 IC2.IN
N$3
  Top 0.254: IC6.26 45.11,60.96 43.28,59.13 43.28,55.88 45.72,53.44 IC6.23
N$4  (via drill 0.61)
  Top 0.254: v29.46,40.64 30.07,41.25 30.07,42.88 33.73,46.53 33.73,50.19 35.76,52.22 35.76,54.25 37.39,55.88 IC6.5
  Bottom 0.254: v29.46,40.64 28.65,40.64 28.65,35.15 25.4,31.9 R13.2
N$5  (via drill 0.61)
  Top 0.254: v40.44,66.85 40.44,55.68 IC6.6
  Bottom 0.254: v40.44,66.85 39.42,67.87 33.93,67.87 25.4,76.4 24.38,76.4 24.18,76.2 R11.2
N$6
  Top 0.254: R11.1 21.74,76.2 21.74,79.86 LED1.A
N$8
  Top 0.254: R6.2 3.86,53.24 5.69,51.41 5.69,36.98 3.86,35.15 3.86,34.34 C2.2
  Bottom 0.254: C3.2 57.1,38 54.05,34.95 52.63,34.95 46.74,29.06 30.48,29.06 26.21,24.79 23.16,24.79 20.52,27.43 14.43,27.43 7.52,34.34 3.86,34.34 C2.2
N$9
  Top 0.254: Q1.2 32.92,48.16 32.92,52.02 C12.2
  Bottom 0.254: IC6.9 38,45.72 37.59,46.13 33.12,46.13 32.31,46.94 31.9,46.94 Q1.2
N$10
  Top 0.254: Q1.1 31.9,41.86 32.92,40.84 32.92,36.98 C13.1
  Bottom 0.254: IC6.10 37.8,42.88 32.72,42.88 Q1.1
N$11
  Bottom 0.254: IC6.14 36.78,31.7 34.34,31.7 C10.1
N$12
  Bottom 0.254: IC2.OUT 34.34,21.74 36.17,23.57 37.39,23.57 40.03,26.21 40.03,27.84 42.88,27.84 47.14,23.57 59.33,23.57 60.15,24.38 61.77,24.38 66.04,20.12 74.78,20.12 75.79,19.1 76.2,19.1 PWR.1
N$13
  Top 0.254: R20.1 11.58,76.2 11.58,79.86 LED3.A
N$14
  Top 0.254: 68.68,55.88 69.29,55.88 69.29,65.43 72.34,68.48 72.34,69.7 R34.S | 68.68,55.88 IC1.6 | 68.68,55.88 68.68,40.64 67.46,39.42 C7.1
N$15
  Top 0.254: R9.1 16.46,22.96 12.8,22.96 C22.2
  Bottom 0.254: 22.35,23.77 22.15,23.57 21.74,23.57 Q2.2 22.35,23.77 | 22.35,23.77 22.55,23.98 25.6,23.98 26.62,22.96 R19.2 | 22.35,23.77 17.48,23.77 16.66,22.96 R9.1
N$16
  Top 0.254: IC1.14 58.52,48.36 62.99,48.36 62.99,62.79 65.43,65.23 65.43,68.07 65.02,68.48 65.02,74.17 66.45,75.59 66.45,78.64 62.38,82.7 LED12.K
N$17
  Top 0.254: R18.1 31.9,76.2 31.9,79.86 LED8.A
N$18
  Top 0.254: R1.S 41.86,15.24 41.86,23.98 C9.2
N$19
  Top 0.254: R36.A 53.44,20.32 57.3,24.18 57.3,25.4 R16.2
  Bottom 0.254: R16.2 IC5.7
N$20
  Top 0.254: R7.1 R4.1
  Bottom 0.254: R7.1 60.96,15.85 53.85,22.96 45.72,22.96 42.06,26.62 C9.1
N$21
  Top 0.254: R23.2 3.66,68.48 3.66,63.6 C16.1 | U1A.14 13.41,55.07 12.8,55.07 11.99,55.88 11.99,60.96 9.55,63.4 8.94,63.4 U1.14
  Bottom 0.254: C16.1 3.86,63.6 4.06,63.8 7.52,63.8 7.72,63.6 8.74,63.6 U1.14
N$22
  Top 0.254: 20.32,29.26 25.4,29.26 C18.1 | 21.74,39.83 23.37,38.2 23.98,38.2 U1.1 | 21.74,39.83 21.13,40.44 21.13,46.74 19.51,48.36 U1A.1 | 21.74,39.83 21.74,36.98 R29.1 18.9,34.14 18.9,30.68 20.32,29.26 | Q3.1 20.32,29.26
N$23
  Top 0.254: 71.12,20.32 72.54,21.74 72.54,22.76 R3.2 72.54,22.96 76.2,22.96 C4.2 | R2.1 71.12,20.32 | 71.12,20.32 IC5.1
N$24
  Top 0.254: U1A.2 19.51,49.17 19.91,49.17 21.74,47.35 21.74,42.27 23.37,40.64 U1.2 | 13.41,29.26 10.16,29.26 C19.2 | 13.41,29.26 15.24,29.26 Q3.2 | 13.41,29.26 13.41,31.09 16.46,34.14 R29.2
  Bottom 0.254: U1.2 23.98,40.64 23.57,40.23 22.15,40.23 16.66,34.75 16.66,34.34 R29.2
N$25
  Top 0.254: IC5.5 R5.1 60.96,36.78 59.74,38 C3.1
N$26
  Top 0.254: R7.2 60.96,17.88 64.62,17.88 R4.2 64.82,17.88 66.85,19.91 66.85,23.77 68.48,25.4 IC5.2 R3.1
  Bottom 0.254: C4.1 76,25.6 72.75,25.6 72.54,25.4 R3.1
N$27
  Top 0.254: R10.2 54.66,28.04 57.1,28.04 R16.1
  Bottom 0.254: IC5.6 60.96,28.04 60.76,28.25 57.51,28.25 57.3,28.04 R16.1
N$28
  Top 0.254: R10.1 54.46,25.4 52.83,27.03 52.83,30.07 54.46,31.7 54.46,32.92 C20.1
N$29
  Top 0.254: R36.S C21.1
N$40
  Top 0.254: IC5.3 70.92,30.28 70.92,33.93 71.12,34.14 R15.1
N$41
  Top 0.254: R22.1 62.38,76.2 62.38,79.86 LED12.A
N$44
  Top 0.254: IC1.13 60.76,50.8 60.76,61.37 64.82,65.43 64.82,67.06 61.57,70.31 61.57,73.56 52.63,82.5 52.22,82.5 LED2.K
N$45
  Top 0.254: R21.1 52.22,76.2 52.22,79.86 LED2.A
N$46  (via drill 0.61)
  Top 0.254: v50.6,56.29 48.77,58.12 48.77,75.18 48.36,75.59 48.36,77.42 v48.77,77.83
  Bottom 0.254: v50.6,56.29 51.41,55.47 56.29,55.47 IC1.12 | v48.77,77.83 43.89,82.7 42.06,82.7 LED10.K
N$47
  Top 0.254: R27.2 72.54,76.2 72.54,79.86 LED11.A
N$48
  Top 0.254: R28.2 42.06,76.2 42.06,79.86 LED10.A
N$49
  Bottom 0.254: IC1.2 67.06,44.7 67.67,44.7 69.09,43.28 72.34,43.28 R31.S
N$50
  Bottom 0.254: IC1.3 66.04,48.36 66.24,48.56 68.07,48.56 71.53,52.02 72.34,52.02 R32.S
N$51  (via drill 0.61)
  Top 0.254: v70.31,57.51 72.34,59.54 72.34,60.96 R33.S
  Bottom 0.254: v70.31,57.51 70.1,57.51 66.04,53.44 IC1.5
N$52
  Top 0.254: IC1.4 65.43,50.8 63.6,48.97 63.6,45.72 66.04,43.28 IC1.1
  Bottom 0.254: IC1.4 66.65,50.8 72.34,56.49 80.06,56.49 80.06,69.9 77.62,72.34 R34.E
N$53
  Top 0.254: R31.A 77.42,40.64 74.78,43.28 74.78,46.33 77.42,48.97 77.42,49.38 R32.A 74.78,52.22 74.78,55.27 77.42,57.91 77.42,58.32 R33.A | R24.1 66.04,69.7 68.48,67.26 68.48,60.15 66.85,58.52 66.04,58.52 IC1.7
  Bottom 0.254: R24.1 66.04,69.9 63.6,72.34 59.74,72.34 C8.1 | IC1.7 66.04,58.52 77.42,58.52 R33.A
PGC
  Bottom 0.254: PICKIT2.5 60.96,65.63 59.33,64.01 57.71,64.01 57.1,63.4 45.72,63.4 IC6.27
PGD
  Bottom 0.254: IC6.28 46.74,65.02 47.35,65.02 48.16,64.21 50.19,64.21 50.39,64.01 56.69,64.01 58.32,65.63 58.32,66.04 PICKIT2.4
PLLACQ  (via drill 0.61)
  Top 0.254: U1A.7 19.51,52.43 23.98,52.43 23.98,53.24 U1.7 24.18,53.24 24.79,53.24 26.42,51.61 26.42,49.58 v27.43,48.56 | v34.75,48.36 v34.75,41.66
  Bottom 0.254: v34.75,41.66 36.98,41.66 38,40.64 IC6.11 | v34.75,48.36 34.14,48.97 27.84,48.97 v27.43,48.56
PTT
  Top 0.254: 31.5,54.05 33.88,54.05 35.15,58.73 37.39,60.96 IC6.3 | 31.5,54.05 29.87,54.05 28.45,52.63 28.45,21.95 26.82,20.32 R19.1 | 31.5,54.05 31.5,57.91 33.53,59.94 33.53,75.59 34.14,76.2 R18.2
RCFB
  Top 0.254: R17.2 C14.2 | U1A.10 19.3,54.46 16.61,54.46 16.61,60.1 22.76,61.16 23.98,61.16 23.98,60.96 U1.10
  Bottom 0.254: U1.10 R17.2
RX-232
  Top 0.254: IC6.18 50.6,40.64 52.02,42.06 SERIAL.1
RXCLOCK
  Top 0.254: U1A.21 13.41,50.39 12.8,50.39 11.18,48.77 11.18,47.35 9.55,45.72 U1.21
  Bottom 0.254: IC6.21 45.72,48.16 45.52,47.95 43.69,47.95 42.47,46.74 36.58,46.74 35.97,47.35 33.73,47.35 32.72,48.36 28.45,48.36 26.82,46.74 10.57,46.74 9.55,45.72 U1.21
RXDATA  (via drill 0.61)
  Top 0.254: U1A.20 13.41,51 v12.19,51 11.18,51 11.18,49.99 9.55,48.36 8.94,48.36 U1.20 | v41.45,58.52 v41.45,55.88
  Bottom 0.254: v41.45,55.88 IC6.24 | v41.45,58.52 40.03,59.94 36.58,59.94 35.76,59.13 26.42,59.13 25.6,59.94 21.29,59.94 13.61,51 v12.19,51
RXDATA/SPKR
  Top 0.254: X1.5 42.27,7.72 39.42,10.57 39.42,20.32 R1.E
  Bottom 0.254: X2.3 19.1,11.58 23.77,16.26 28.65,16.26 29.67,17.27 35.56,17.27 38.61,20.32 R1.E
RXDCACQ  (via drill 0.61)
  Top 0.254: v18.09,51.41 18.09,51.61 19.3,51.61 U1A.6 | v35.76,50.6 35.76,38.2 38,38.2 IC6.12
  Bottom 0.254: v18.09,51.41 18.69,50.8 U1.6 26.01,50.8 26.62,50.19 35.36,50.19 v35.76,50.6
RXHOLD  (via drill 0.61)
  Top 0.254: U1A.5 19.51,51 21.74,51 21.74,49.99 23.37,48.36 23.98,48.36 U1.5 24.18,48.16 24.79,48.16 26.42,46.53 26.42,44.91 v26.62,44.7
  Bottom 0.254: v26.62,44.7 31.09,40.23 32.92,40.23 36.58,36.58 36.98,36.58 38,35.56 IC6.13
RXSIGIN  (via drill 0.61)
  Top 0.254: U1A.11 19.51,55.07 21.13,55.07 21.13,57.51 23.57,59.94 26.42,59.94 26.42,61.77 27.84,63.2 27.84,63.4 R17.1 | U1.11 24.18,63.6 27.84,63.6 R17.1 | v42.47,59.54 42.47,49.78 46.94,49.78 54.05,42.67 54.05,38.81 59.13,33.73 59.13,13.61 66.85,13.61 68.48,15.24 R2.2 | R17.1 28.04,63.6 31.7,63.6 C14.1
  Bottom 0.254: v42.47,59.54 40.03,61.98 36.58,61.98 35.15,63.4 31.9,63.4 C14.1
RXSN  (via drill 0.61)
  Top 0.254: U1.23 9.55,40.64 11.79,42.88 11.79,48.36 12.6,49.17 13.41,49.17 U1A.23 13.61,49.17 15.04,49.17 15.85,49.99 15.85,50.39 v18.09,52.63
  Bottom 0.254: 30.48,57.1 27.43,54.05 27.23,54.05 24.99,51.82 22.55,51.82 21.74,52.63 v18.09,52.63 | 30.48,57.1 30.68,57.1 32.31,55.47 33.73,55.47 35.15,56.9 41.05,56.9 44.09,59.94 47.75,59.94 49.17,61.37 55.88,61.37 57.91,63.4 65.43,63.4 65.43,67.87 63.6,69.7 R24.2 | 30.48,57.1 R14.1
TRXPTT
  Top 0.254: Q2.3 22.96,21.54 22.96,17.88 D2.C 22.96,17.68 22.96,12.6 X2.4
  Bottom 0.254: X1.3 48.97,7.72 43.28,13.41 35.15,13.41 31.9,16.66 29.87,16.66 26.42,13.21 23.77,13.21 22.15,11.58 21.95,11.58 X2.4
TX-232
  Bottom 0.254: IC6.17 45.72,38 45.92,37.8 50.8,37.8 51.61,36.98 52.02,36.98 SERIAL.3
TX/SN
  Top 0.254: R14.2 33.12,57.3 34.54,58.73 34.54,60.55 37.39,63.4 38,63.4 IC6.2
  Bottom 0.254: C1.1 31.09,65.43 34.95,65.43 36.58,63.8 36.78,63.8 36.98,63.6 38,63.6 IC6.2
TXCLOCK  (via drill 0.61)
  Top 0.254: v14.83,50.19 14.83,49.99 14.63,49.78 13.61,49.78 U1A.22
  Bottom 0.254: U1.19 9.55,50.8 10.36,49.99 14.63,49.99 v14.83,50.19 15.24,49.78 25.6,49.78 25.81,49.58 36.37,49.58 36.58,49.78 44.7,49.78 IC6.22
TXDATA  (via drill 0.61)
  Top 0.254: v15.85,51.61 13.61,51.61 U1A.19 | v25.81,54.46 v29.06,54.46
  Bottom 0.254: v15.85,51.61 18.69,54.46 v25.81,54.46 | v29.06,54.46 29.46,54.05 33.73,54.05 36.98,50.8 IC6.7
TXDATA/MIC
  Top 0.254: X1.1 47.14,7.72 47.35,7.92 47.35,16.05 50.19,18.9 50.19,21.74 48.56,23.37 48.56,24.59 48.36,24.79 48.36,25.4 C21.2
  Bottom 0.254: C21.2 47.75,25.4 44.7,28.45 37.39,28.45 34.34,25.4 R8.1 34.14,25.4 27.43,18.69 26.01,18.69 25.2,19.51 21.54,19.51 13.61,11.58 X2.1
TXOUT
  Top 0.254: U1A.16 13.41,53.65 11.99,53.65 11.99,55.07 11.18,55.88 11.18,56.69 9.55,58.32 8.94,58.32 U1.16
  Bottom 0.254: R6.1 3.86,55.88 6.1,58.12 7.52,58.12 7.72,58.32 8.74,58.32 U1.16
USB+
  Top 0.254: IC6.16 50.6,35.56 50.6,27.84 52.63,25.81 52.63,22.96 51.61,21.95 51.61,18.69 62.79,7.52 63.4,7.52 J1.D+
USB-  (via drill 0.61)
  Top 0.254: v46.33,18.9 46.33,32.31 45.72,32.92 IC6.15
  Bottom 0.254: v46.33,18.9 48.16,17.07 55.27,17.07 62.79,9.55 63.4,9.55 J1.D-
VBIAS  (via drill 0.61)
  Top 0.254: U1A.9 19.51,53.65 21.74,53.65 21.74,56.69 23.37,58.32 23.98,58.32 U1.9 24.18,58.52 28.85,58.52 28.85,56.49 v30.28,55.07 | C6.1 52.22,46.94 59.13,40.03 60.76,40.03 60.76,39.62 63.4,36.98 63.4,34.34 R5.2
  Bottom 0.254: R5.2 63.6,34.14 68.48,34.14 R15.2 | v30.28,55.07 30.48,54.86 39.62,54.86 42.67,51.82 46.94,51.82 51.61,47.14 52.02,47.14 C6.1
VCC
  Top 0.254: 24.18,43.69 24.18,45.72 U1.4 23.98,45.72 22.35,47.35 22.35,47.55 19.51,50.39 U1A.4 19.3,50.39 19.1,50.19 | 24.18,43.69 24.18,43.28 U1.3 24.18,43.69 | 24.18,43.69 26.42,41.45 26.42,35.36 25.4,34.34 R13.1 | 14.43,47.55 13.61,48.36 U1A.24 | 14.43,47.55 17.88,47.55 17.88,48.97 19.1,50.19 | 19.1,50.19 19.1,49.99 19.3,49.78 U1A.3 | 14.43,47.55 14.43,38.2 8.94,38.2 U1.24 | R20.2 13.82,76.2 13.82,71.12 C5.1 | U1A.15 13.61,54.46 14.02,54.46 14.43,54.05 14.43,53.03 13.61,53.03 U1A.17 13.41,53.03 11.38,53.03 11.38,54.05 9.55,55.88 U1.17 8.13,55.88 6.5,57.51 6.5,58.73 8.74,60.96 U1.15 | C11.1 74.17,12.19 74.17,14.63 76.2,16.66 PWR.2 | PICKIT2.2 53.24,66.04 53.24,60.76 52.22,59.74 R25.1 52.22,59.54 52.22,59.33 54.25,57.3 54.25,45.72 IC1.15 58.52,45.72 58.52,43.28 IC1.16 65.23,36.37 65.23,27.23 60.96,22.96 IC5.8 | R12.1 44.3,69.9 44.3,76.2 R28.1
  Bottom 0.254: 5.08,49.58 6.5,51 6.5,55.88 U1.17 | 5.08,49.58 3.86,48.36 C17.2 | C5.1 13.82,71.12 13.82,60.96 U1.15 | 5.08,49.58 5.69,49.58 5.69,41.25 8.74,38.2 U1.24 | IC5.8 60.96,22.76 64.21,19.51 72.95,19.51 75.79,16.66 76.2,16.66 PWR.2 | IC1.15 57.91,45.72 57.3,45.11 47.95,45.11 47.75,45.31 46.13,45.31 IC6.20 43.89,45.72 42.88,44.7 31.7,44.7 30.68,45.72 U1.4 | R27.1 69.7,76.2 69.49,76.4 65.02,76.4 64.82,76.2 R22.2 64.62,76.2 62.99,77.83 51.41,77.83 49.78,76.2 R21.2 49.38,76.2 49.17,76.4 44.7,76.4 44.5,76.2 R28.1 | PICKIT2.2 53.24,66.04 49.58,69.7 44.5,69.7 R12.1
VPP
  Top 0.254: 38.2,69.7 38.2,69.09 38.41,68.89 38.41,66.24 38.2,66.04 IC6.1 | 38.2,69.7 41.86,69.7 R12.2 | 38.2,69.7 PROG.2
  Bottom 0.254: PICKIT2.1 48.77,68.07 43.89,68.07 42.27,69.7 42.06,69.7 R12.2

### Text on the board
tNames: PWR | COS | PTT | LOW | MED | HIGH | DCOS | DCOS | LOW | MED | HIGH | RX | TX | www.gmskhotspot.com | NQSMHS V2.5B | NI2O 02/2012